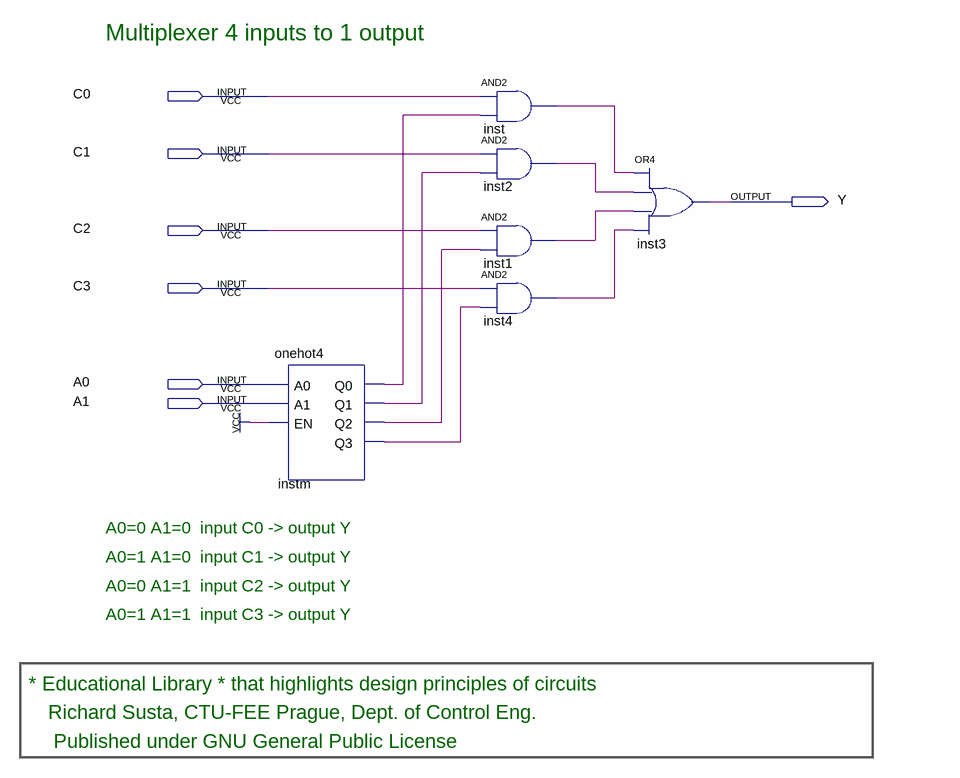
[diagram p0: schematic sheet]
// Quartus schematic mux4to1.bdf as structural Verilog: 6 symbols, 7 pins
module mux4to1 (
  input  C0,
  input  C1,
  input  C2,
  input  C3,
  input  A0,
  input  A1,
  output Y
);

  wire inst1_out, inst2_out, inst4_out, inst_out, instm_q0, instm_q1, instm_q2, instm_q3;

  onehot4 instm (.A0(A0), .A1(A1), .EN(1'b1), .Q0(instm_q0), .Q1(instm_q1), .Q2(instm_q2), .Q3(instm_q3));
  and inst (inst_out, C0, instm_q0);
  and inst2 (inst2_out, C1, instm_q1);
  and inst1 (inst1_out, C2, instm_q2);
  and inst4 (inst4_out, C3, instm_q3);
  or inst3 (Y, inst_out, inst2_out, inst1_out, inst4_out);

  // Notes on the sheet:
  //   Multiplexer 4 inputs to 1 output
  //   A0=0 A1=0  input C0 -> output Y
  //   A0=1 A1=0  input C1 -> output Y
  //   A0=0 A1=1  input C2 -> output Y
  //   A0=1 A1=1  input C3 -> output Y
  //   * Educational Library * that highlights design principles of circuits
  //   Richard Susta, CTU-FEE Prague, Dept. of Control Eng. 
  //    Published under GNU General Public License
endmodule
